# EasyEDA schematic SCH_ESQUEMA_EASY_EDA_2026-10-01.json
TITLE: Sheet_1; REV: 1.0; Date: 2026-09-30; Sheet: 1/1; Company: Your Company
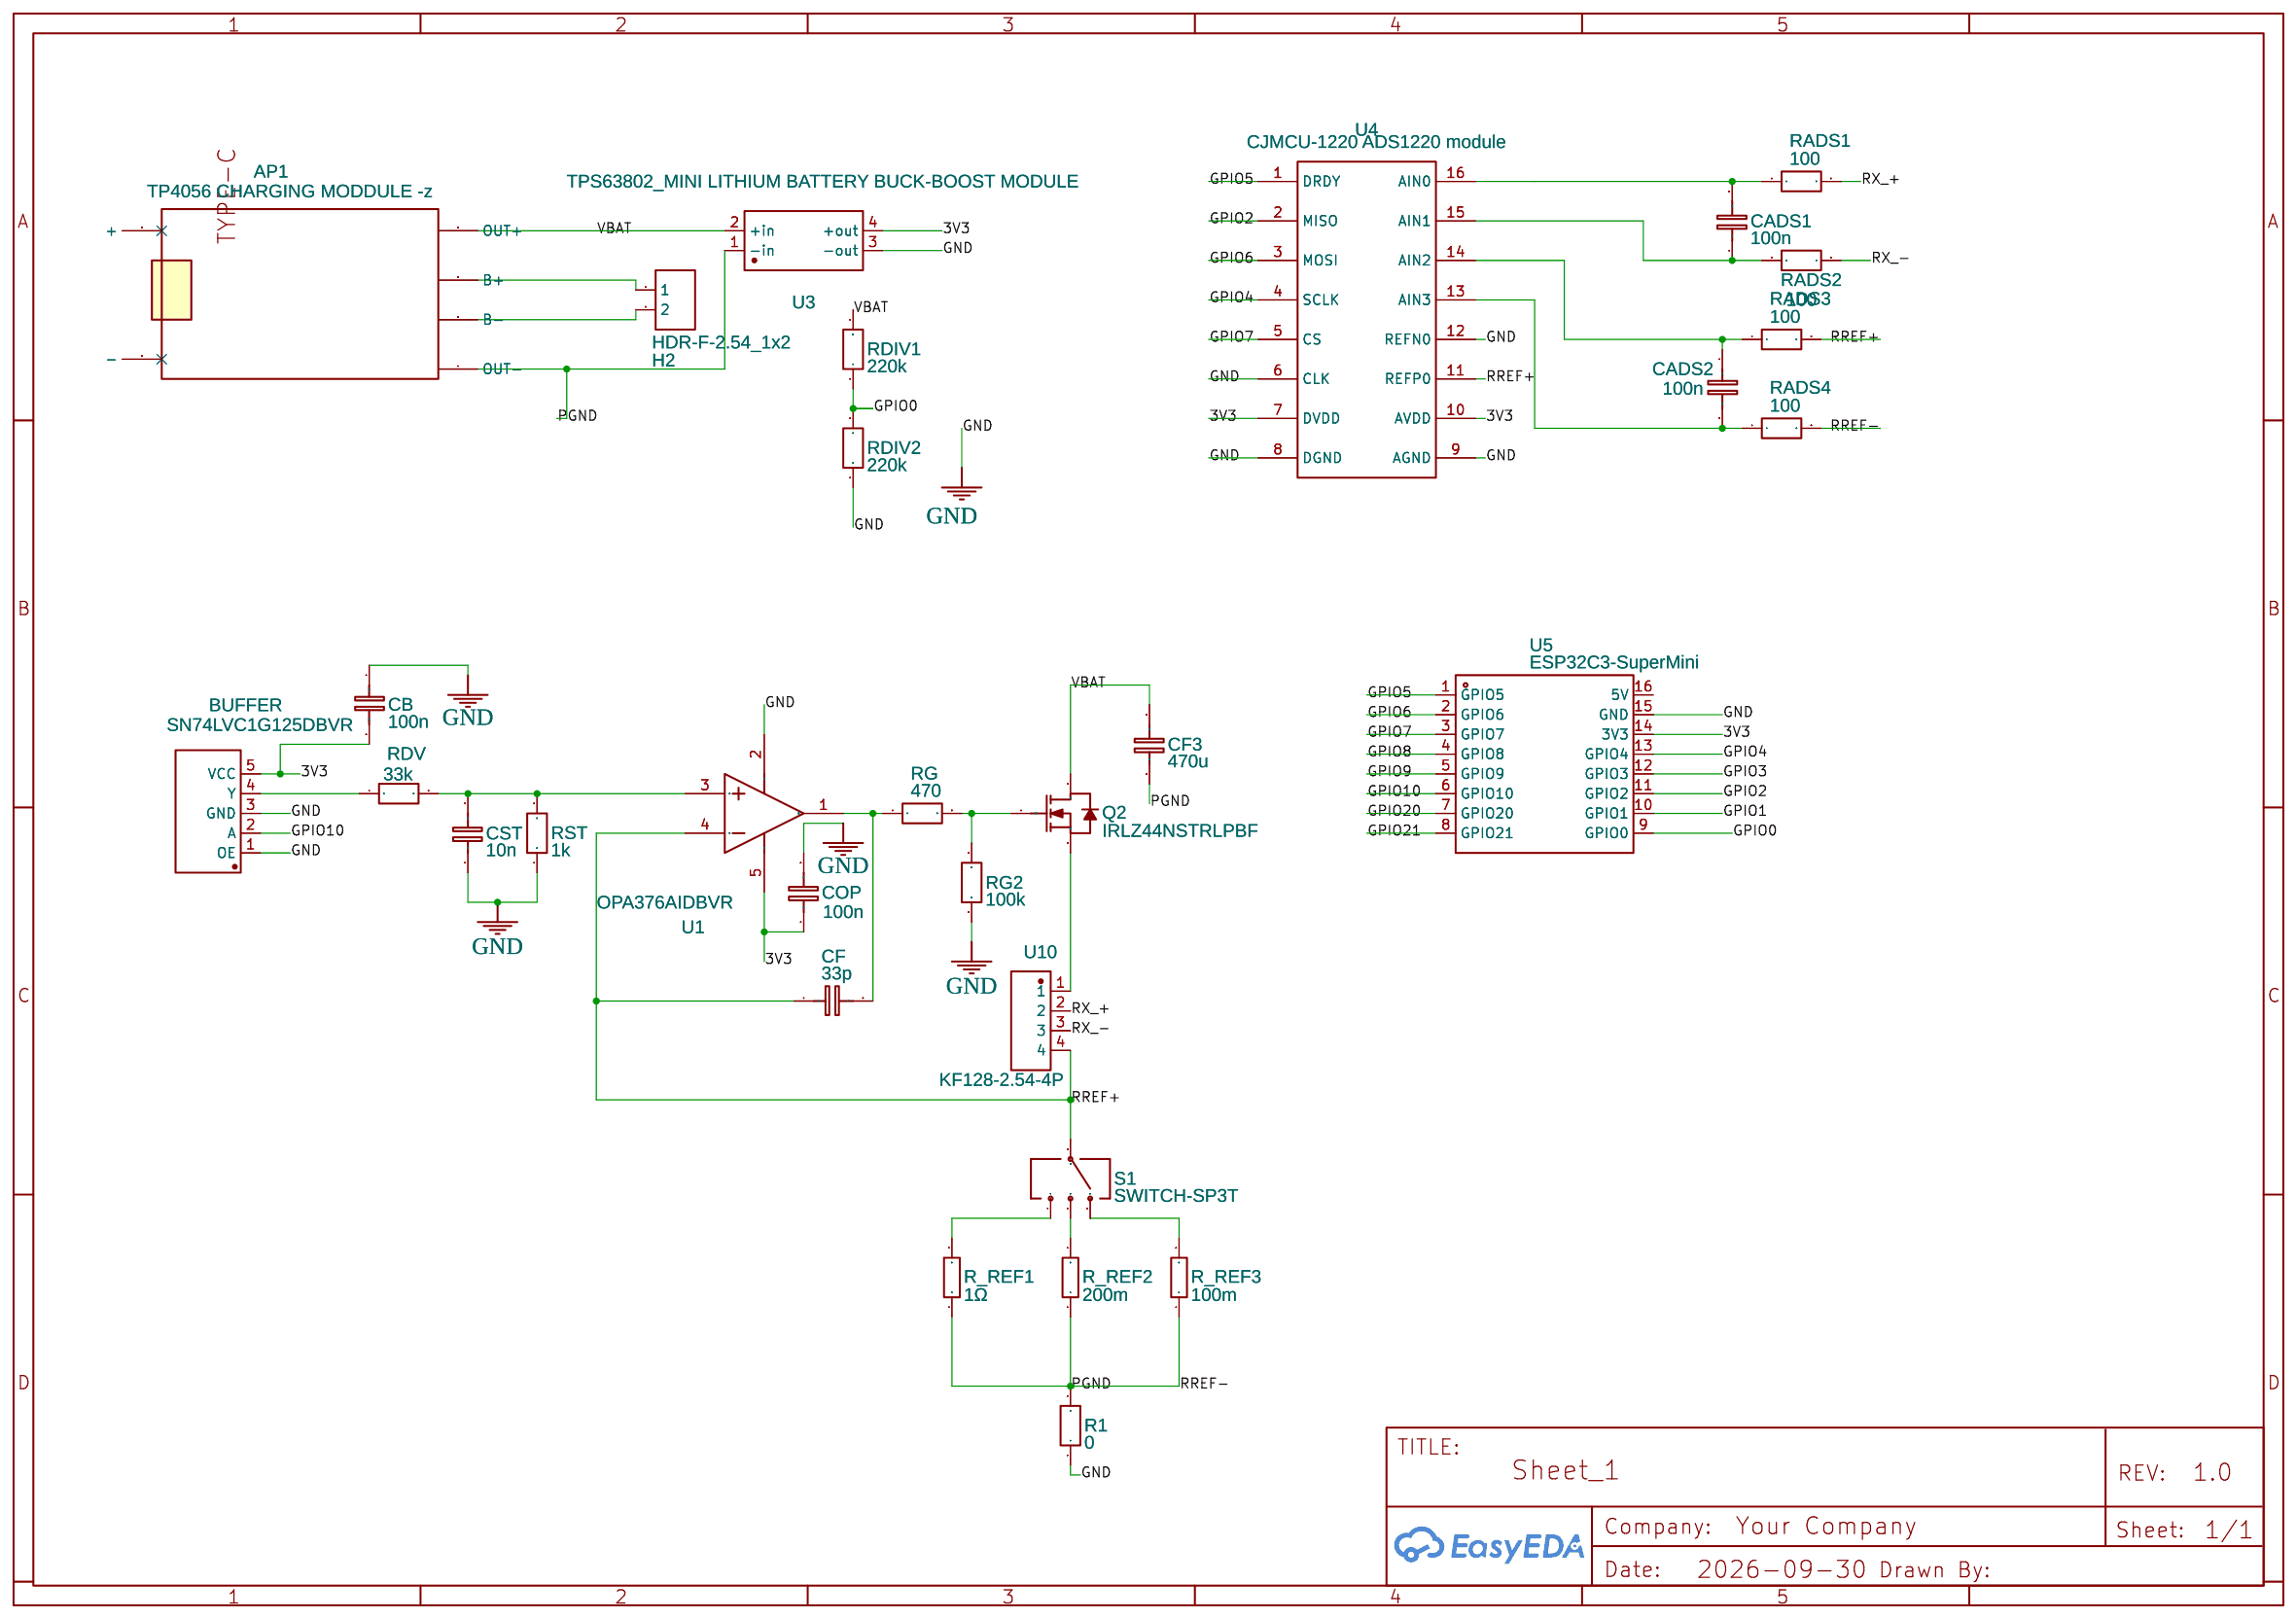
[diagram p0: schematic sheet]

## Parts
AP1  TP4056 CHARGING MODDULE -z  [TPS63802_MINIMODULE_FOOTPRINT]
BUFFER  SN74LVC1G125DBVR  [SOT-23-5_L3.0-W1.7-P0.95-LS2.8-BL]
CADS1  100n  [C0603]
CADS2  100n  [C0603]
CB  100n  [C0603]
CF  33p  [C0603]
CF3  470u  [C0603]
COP  100n  [C0603]
CST  10n  [C0603]
H2  HDR-F-2.54_1x2  [HDR-F-2.54_1X2]
Q2  IRLZ44NSTRLPBF  [TO-263-2_L10.1-W9.1-P5.08-LS15.2-BR]
R1  0  [R0603]
R_REF1  1Ω  [R1206]
R_REF2  200m  [R2512]
R_REF3  100m  [R2512]
RADS1  100  [R0603]
RADS2  100  [R0603]
RADS3  100  [R0603]
RADS4  100  [R0603]
RDIV1  220k  [R0603]
RDIV2  220k  [R0603]
RDV  33k  [R0603]
RG  470  [R0603]
RG2  100k  [R0603]
RST  1k  [R0603]
S1  SWITCH-SP3T  [SWITCH-SP3T-SMD]
U1  OPA376AIDBVR  [SOT-23-5_L3.0-W1.7-P0.95-LS2.8-BR]
U3  TPS63802_MINI LITHIUM BATTERY BUCK-BOOST MODULE  [TPS63802_MINIMODULE_FOOTPRINT]
U4  CJMCU-1220 ADS1220 module  [CJMCU-1220 MODULE]
U5  ESP32C3-SuperMini  [ESP32-C3_SUPERMINI:MODULE_ESP32-C3_SUPERMINI]
U10  KF128-2.54-4P  [CONN-TH_4P-P2.54_KF128-2.54-4P]

## Library data of the parts
AP1 = TP4056 CHARGING MODDULE: Manufacturer Part: TP4056; Contributor: zcam29112000
BUFFER = SN74LVC1G125DBVR: Supplier: LCSC; Manufacturer: TI(德州仪器); Supplier Part: C23654; JLCPCB Part Class: Extended Part
CADS1 CADS2 CB CF CF3 COP CST = C_0603_EU: Contributor: LCEDA_Lib
H2 = HDR-F-2.54_1x2: Supplier Part: C49661; Supplier: LCSC; Contributor: LCEDA_Lib
Q2 = IRLZ44NSTRLPBF: Contributor: LCSC; Supplier: LCSC; Supplier Part: C538199; Manufacturer: Infineon(英飞凌); JLCPCB Part Class: Extended Part
R1 RADS1-RADS4 RDIV1 RDIV2 RDV RG RG2 RST = R_0603_EU: Contributor: LCEDA_Lib
R_REF1 = RC1206FR-071RL: Contributor: LCSC; Supplier: LCSC; Manufacturer: YAGEO(国巨); Supplier Part: C137355; JLCPCB Part Class: Extended Part
R_REF2 R_REF3 = 0.16Ω±1%2W-2512: Contributor: lcsc; Supplier: LCSC; Supplier Part: C9900013604; Manufacturer: null; JLCPCB Part Class: Extended Part
S1 = SWITCH-SP3T: Contributor: SparkFun
U1 = OPA376AIDBVR: Supplier: LCSC; Manufacturer: TI(德州仪器); Supplier Part: C42134; JLCPCB Part Class: Extended Part
U3 = TPS63802_MINI LITHIUM BATTERY BUCK-BOOST MODULE: Contributor: emenstanougat; Package Display: No
U4 = CJMCU-1220 ADS1220 module: Contributor: addinulhsb
U5 = ESP32C3-SuperMini: Symbol: ESP32C3-SUPERMINI; Supplier Part: C9900147397; Supplier Footprint: SMD-16P; JLCPCB Part Class: Extended Part; Supplier: LCSC; Add into BOM: yes; Convert to PCB: yes; Contributor: sandybahtiar620
U10 = KF128-2.54-4P: Contributor: LCSC; Supplier: LCSC; Supplier Part: C474922; Manufacturer: KEFA(科发); JLCPCB Part Class: Extended Part

## Nets
3V3: BUFFER.5(VCC) CB.2 COP.1 U1.5(V+) U3.4(+out) U4.7(DVDD) U4.10(AVDD) U5.14(3V3)
GND: BUFFER.1(OE) BUFFER.3(GND) CB.1 COP.2 CST.1 R1.1 RDIV2.1 RG2.1 RST.1 U1.2(V-) U3.3(-out) U4.6(CLK) U4.8(DGND) U4.9(AGND) U4.12(REFN0) U5.15(GND)
PGND: AP1.4(OUT-) CF3.1 R1.2 R_REF1.1 R_REF2.1 R_REF3.1 RADS4.2 U3.1(-in)
VBAT: AP1.3(OUT+) CF3.2 Q2.2(D) RDIV1.2 U3.2(+in)
GPIO0: RDIV1.1 RDIV2.2 U5.9(GPIO0)
GPIO1: U5.10(GPIO1)
GPIO2: U4.2(MISO) U5.11(GPIO2)
GPIO3: U5.12(GPIO3)
GPIO4: U4.4(SCLK) U5.13(GPIO4)
GPIO5: U4.1(DRDY) U5.1(GPIO5)
GPIO6: U4.3(MOSI) U5.2(GPIO6)
GPIO7: U4.5(CS) U5.3(GPIO7)
GPIO8: U5.4(GPIO8)
GPIO9: U5.5(GPIO9)
GPIO10: BUFFER.2(A) U5.6(GPIO10)
GPIO20: U5.7(GPIO20)
GPIO21: U5.8(GPIO21)
RREF+: CF.1 RADS3.2 S1.3 U1.4(IN-) U4.11(REFP0) U10.4
RX_+: RADS1.2 U10.2
RX_-: RADS2.2 U10.3
Net-(AP1-1): AP1.1(B+) H2.1
Net-(AP1-2): AP1.2(B-) H2.2
Net-(BUFFER-4): BUFFER.4(Y) RDV.1
Net-(CADS1-1): CADS1.1 RADS2.1 U4.15(AIN1)
Net-(CADS1-2): CADS1.2 RADS1.1 U4.16(AIN0)
Net-(CADS2-1): CADS2.1 RADS3.1 U4.14(AIN2)
Net-(CADS2-2): CADS2.2 RADS4.1 U4.13(AIN3)
Net-(CF-2): CF.2 RG.1 U1.1(OUT)
Net-(CST-2): CST.2 RDV.2 RST.2 U1.3(IN+)
Net-(Q2-1): Q2.1(G) RG.2 RG2.2
Net-(Q2-3): Q2.3(S) U10.1
Net-(R_REF1-2): R_REF1.2 S1.4
Net-(R_REF2-2): R_REF2.2 S1.2
Net-(R_REF3-2): R_REF3.2 S1.1

Not connected (* = marked no-connect by the designer): AP1 5(+)* 6(-)*; U5 16(5V)
